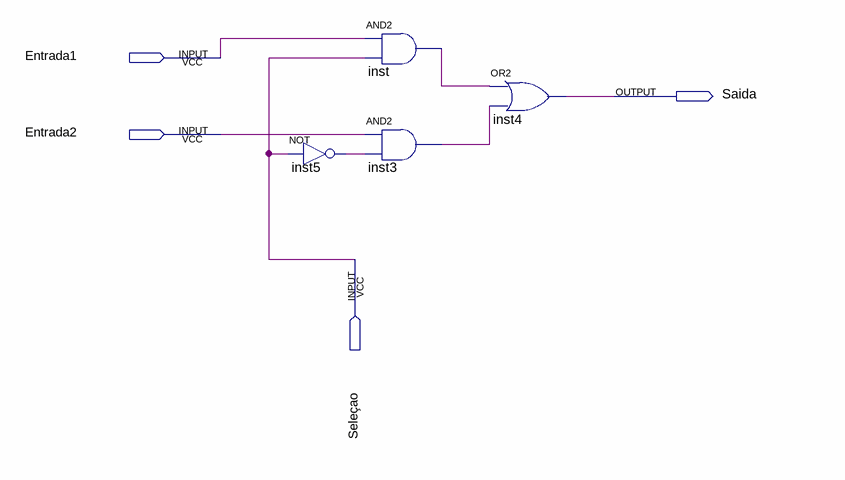
[diagram p0: schematic sheet]
// Quartus schematic Mux2x1.bdf as structural Verilog: 4 symbols, 4 pins
module Mux2x1 (
  input  Entrada1,
  input  Entrada2,
  input  \Seleçao ,
  output Saida
);

  wire inst3_out, inst5_out, inst_out;

  not inst5 (inst5_out, \Seleçao );
  and inst (inst_out, Entrada1, \Seleçao );
  and inst3 (inst3_out, Entrada2, inst5_out);
  or inst4 (Saida, inst_out, inst3_out);
endmodule
